# Altium project Transceiver-JB.PrjPcb
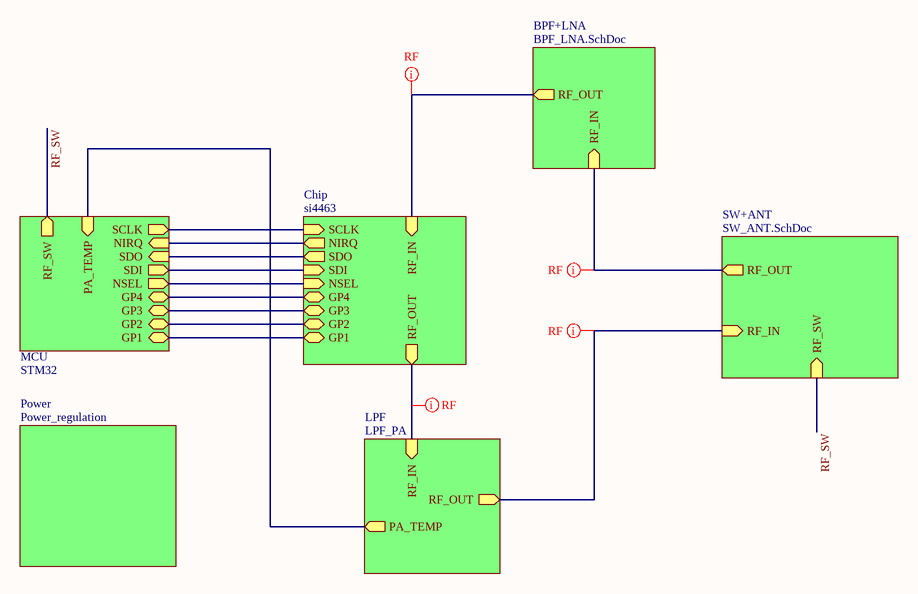
[diagram p0: Overview.SchDoc]
7 sheets, 95 parts. Net scope: hierarchical (ports join the sheet entries above them; power ports are global).
Board file: PCB_TRANSCIEVER.PcbDoc
Sheets:
  Overview.SchDoc
    STM32 = MCU.SchDoc
    Chip = si4463.SchDoc
    Power = Power_regulation.SchDoc
    LPF = LPF_PA.SchDoc
    BPF+LNA = BPF_LNA.SchDoc
    SW+ANT = SW_ANT.SchDoc

## Sheet Overview.SchDoc
size A; SheetNumber: 1; SheetTotal: 7

### Sub-sheets
BPF+LNA = BPF_LNA.SchDoc: RF_OUT (out), RF_IN (in)
Chip = si4463: SDI (in), SDO (out), NIRQ (out), SCLK (in), NSEL (in), RF_IN (in), RF_OUT (out), GP1 (bidir), GP2 (bidir), GP3 (bidir), GP4 (bidir)
LPF = LPF_PA: RF_IN (in), RF_OUT (out), PA_TEMP (out)
Power = Power_regulation: no entries
STM32 = MCU: NSEL (out), NIRQ (in), SDI (out), SDO (in), SCLK (out), RF_SW (out), GP1 (bidir), GP2 (bidir), GP3 (bidir), GP4 (bidir), PA_TEMP (in)
SW+ANT = SW_ANT.SchDoc: RF_OUT (out), RF_IN (in), RF_SW (in)

### Nets
NIRQ: sheet STM32/NIRQ, sheet Chip/NIRQ
NSEL: sheet STM32/NSEL, sheet Chip/NSEL
RF_SW: sheet STM32/RF_SW, sheet SW+ANT/RF_SW
SCLK: sheet STM32/SCLK, sheet Chip/SCLK
SDI: sheet STM32/SDI, sheet Chip/SDI
SDO: sheet STM32/SDO, sheet Chip/SDO
NetC5_1: sheet Chip/RF_IN, sheet BPF+LNA/RF_OUT
NetC31_2: sheet LPF/RF_OUT, sheet SW+ANT/RF_IN
NetC36_1: sheet Chip/RF_OUT, sheet LPF/RF_IN
NetC46_1: sheet BPF+LNA/RF_IN, sheet SW+ANT/RF_OUT
NetIC2_23: sheet STM32/PA_TEMP, sheet LPF/PA_TEMP
NetIC2_26: sheet STM32/GP1, sheet Chip/GP1
NetIC2_27: sheet STM32/GP2, sheet Chip/GP2
NetIC2_28: sheet STM32/GP3, sheet Chip/GP3
NetIC2_54: sheet STM32/GP4, sheet Chip/GP4

### Layout directives
rule Impedance Constraint [Min = 50.00    Max = 50.00    ]; net class RF: NetC5_1, NetC31_2, NetC36_1, NetC46_1

### Notes on the sheet
- DWG NO:
- REV:
- THIS DOCUMENT AND THE DATA DISCLOSED HEREIN OR
- HEREWITH IS THE PROPERTY OF ALTIUM LIMITED AND MAY
- BE FREELY DISTRIBUTED IN WHOLE. NO RIGHTS ARE
- RESERVED OR EXPRESS OR IMPLIED WARANTEE GIVEN.
- REVISION
- DESCRIPTION
- DATE
- APPROVED
- ENG:
- APPROVALS
- PROJECT
- DSN:
- CHK:
- REFERENCE DOCUMENTS
- PROJECT REVISION:
- TITLE
- DOCUMENT REVISION:
- DESIGN ITEM:
- BOM:
- FAB DWG:
- PCB DWG:
- ASSY DWG:
- SCALE:
- A2
- SIZE
- CAGE CODE
- FILE NAME
- DWG NO.
- SHEET
- OF
- REV

## Sheet MCU.SchDoc
size A; SheetNumber: 5; SheetTotal: 7
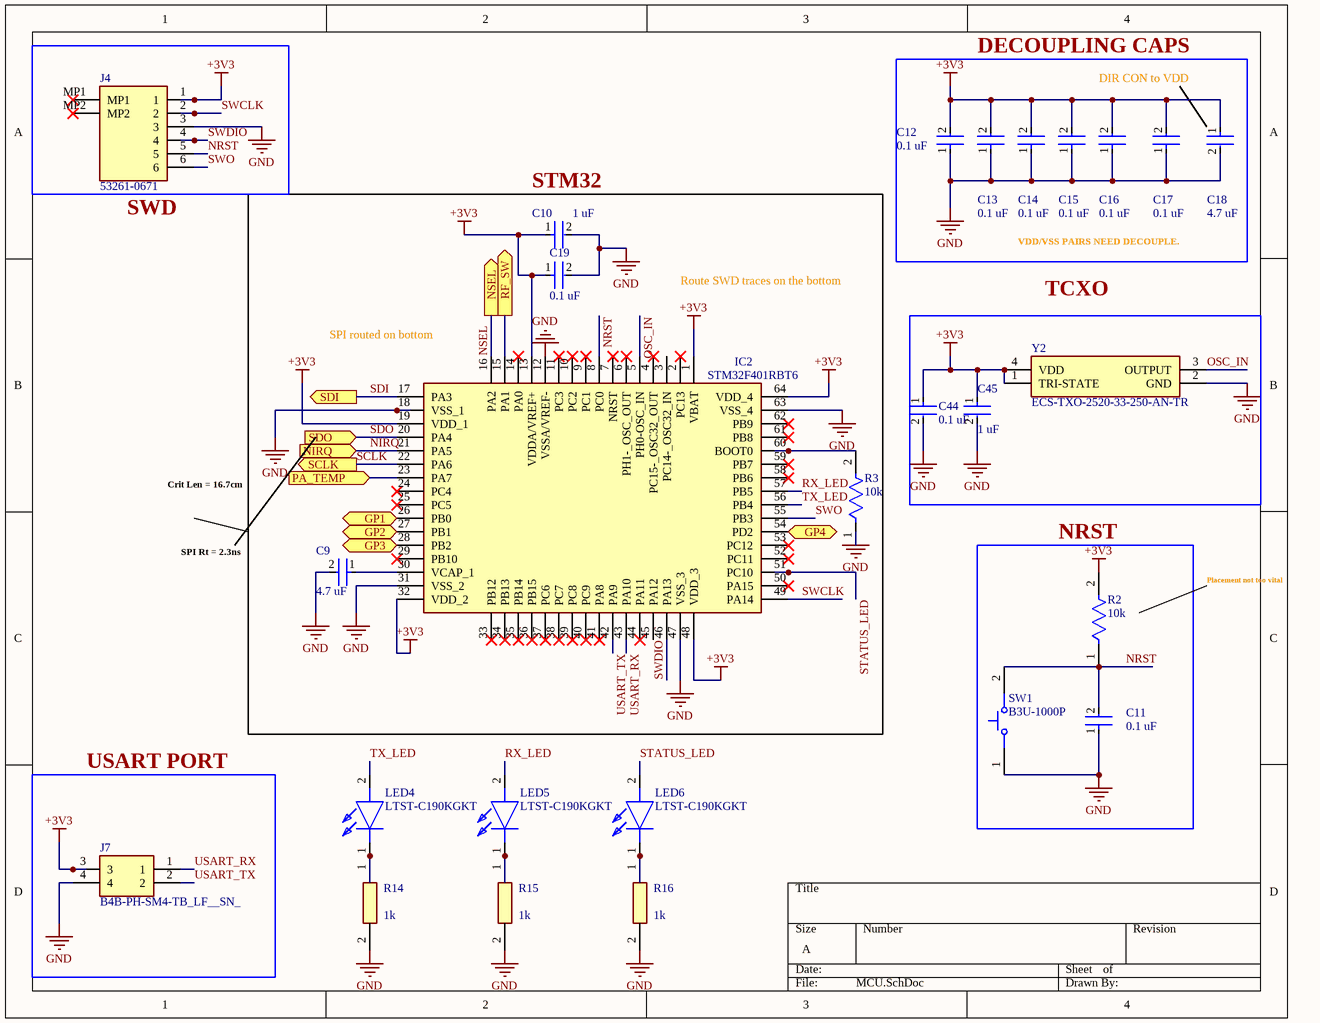
[diagram p1: MCU.SchDoc]

### Parts
C9  4.7 uF  [FP-GRM188-0_15-IPC_C]
C10  1 uF  [FP-C0402C105K9PACTU-MFG]
C11  0.1 uF  [FP-GRM033-0_03-MFG]
C12  0.1 uF  [FP-GRM033-0_03-MFG]
C13  0.1 uF  [FP-GRM033-0_03-MFG]
C14  0.1 uF  [FP-GRM033-0_03-MFG]
C15  0.1 uF  [FP-GRM033-0_03-MFG]
C16  0.1 uF  [FP-GRM033-0_03-MFG]
C17  0.1 uF  [FP-GRM033-0_03-MFG]
C18  4.7 uF  [FP-GRM188-0_15-IPC_C]
C19  0.1 uF  [FP-GRM033-0_03-MFG]
C44  0.1 uF  [FP-GRM033-0_03-MFG]
C45  1 uF  [FP-C0402C105K9PACTU-MFG]
IC2  STM32F401RBT6  [QFP50P1200X1200X160-64N]
J4  53261-0671  [532610671]
J7  B4B-PH-SM4-TB_LF__SN_  [B4B-PH-SM4_1]
LED4  LTST-C190KGKT  [LEDC1608X80N]
LED5  LTST-C190KGKT  [LEDC1608X80N]
LED6  LTST-C190KGKT  [LEDC1608X80N]
R2  10k  [FP-RMCF0402-IPC_C]
R3  10k  [FP-RMCF0402-IPC_C]
R14  1k  [RESC1608X55N]
R15  1k  [RESC1608X55N]
R16  1k  [RESC1608X55N]
SW1  B3U-1000P  [OMRON-B3U-1000_V]
Y2  ECS-TXO-2520-33-250-AN-TR  [ECSTXO252033250ANTR]

### Blocks framed on the sheet
DECOUPLING CAPS: C12-C18
STM32: C9 C10 C19 IC2 R3
TCXO: C44 C45 Y2
NRST: C11 R2 SW1
USART PORT: J7

### Ports
GP1 (bidir, see Overview[1B], si4463[3A]), GP2 (bidir, see Overview[1B], si4463[3A]), GP3 (bidir, see Overview[1B], si4463[3B]), GP4 (bidir, see Overview[1B], si4463[3B]), NIRQ (in, see Overview[1B], si4463[3A]), NSEL (out, see Overview[1B], si4463[3B]), PA_TEMP (in, see Overview[1B], LPF_PA[1C]), RF_SW (out, see Overview[1B], SW_ANT[3C]), SCLK (out, see Overview[1B], si4463[3A]), SDI (out, see Overview[1B], si4463[3B]), SDO (in, see Overview[1B], si4463[3A])

### Nets
+3V3: C10.1 C12.2 C13.2 C14.2 C15.2 C16.2 C17.2 C18.1 C19.1 C44.1 C45.1 IC2.1(VBAT) IC2.13(VDDA/VREF+) IC2.19(VDD_1) IC2.32(VDD_2) IC2.48(VDD_3) IC2.64(VDD_4) J4.1 J7.3 R2.2 Y2.1(TRI-STATE) Y2.4(VDD)  [project net 3V3]
GND: C9.2 C10.2 C11.1 C12.1 C13.1 C14.1 C15.1 C16.1 C17.1 C18.2 C19.2 C44.2 C45.2 IC2.12(VSSA/VREF-) IC2.18(VSS_1) IC2.31(VSS_2) IC2.47(VSS_3) IC2.63(VSS_4) J4.3 J7.4 R3.1 R14.2 R15.2 R16.2 SW1.1 Y2.2(GND)
NIRQ: IC2.21(PA5) ; port NIRQ
NRST: C11.2 IC2.8(PC0) J4.5 R2.1 SW1.2
NSEL: IC2.16(PA2) ; port NSEL
OSC_IN: IC2.5(PH0-OSC_IN) Y2.3(OUTPUT)
RF_SW: IC2.15(PA1) ; port RF_SW
RX_LED: IC2.57(PB5) LED5.2(A)
SCLK: IC2.22(PA6) ; port SCLK
SDI: IC2.17(PA3) ; port SDI
SDO: IC2.20(PA4) ; port SDO
STATUS_LED: IC2.51(PC10) LED6.2(A)
SWCLK: IC2.49(PA14) J4.2
SWDIO: IC2.46(PA13) J4.4
SWO: IC2.55(PB3) J4.6
TX_LED: IC2.56(PB4) LED4.2(A)
USART_RX: IC2.43(PA10) J7.1
USART_TX: IC2.42(PA9) J7.2
NetC9_1: C9.1 IC2.30(VCAP_1)
NetIC2_23: IC2.23(PA7) ; port PA_TEMP
NetIC2_26: IC2.26(PB0) ; port GP1
NetIC2_27: IC2.27(PB1) ; port GP2
NetIC2_28: IC2.28(PB2) ; port GP3
NetIC2_54: IC2.54(PD2) ; port GP4
NetIC2_60: IC2.60(BOOT0) R3.2
NetLED4_1: LED4.1(K) R14.1
NetLED5_1: LED5.1(K) R15.1
NetLED6_1: LED6.1(K) R16.1

Not connected (* = marked no-connect by the designer): IC2 2(PC13)* 3(PC14-_OSC32_IN) 4(PC15-_OSC32_OUT)* 6(PH1-_OSC_OUT)* 7(NRST)* 9(PC1)* 10(PC2)* 11(PC3)* 14(PA0)* 24(PC4)* 25(PC5)* 29(PB10)* 33(PB12)* 34(PB13)* 35(PB14)* 36(PB15)* 37(PC6)* 38(PC7)* 39(PC8)* 40(PC9)* 41(PA8)* 44(PA11)* 45(PA12) 50(PA15)* 52(PC11)* 53(PC12)* 58(PB6)* 59(PB7)* 61(PB8)* 62(PB9)*; J4 MP1* MP2*

### Notes on the sheet
- DIR CON to VDD
- (near J4) SWD
- Route SWD traces on the bottom
- VDD/VSS PAIRS NEED DECOUPLE.
- (near IC2) SPI routed on bottom
- Crit Len = 16.7cm
- SPI Rt = 2.3ns
- Placement not too vital

### Library data of the parts
C9 C18 = CMP-2006-02523-2: Chip Multilayer Ceramic Capacitors for General Purpose, 0603, 4.7uF, X5R, 15%, 10%, 25V Name: GRM188R61E475KE11D; Case Code (Metric): 1608; Max Operating Temperature: 85°C; REACH SVHC: No SVHC; Voltage Rating: 25V; Dielectric: X5R; Packaging: Cut Tape; Width: 0.031inch; Min Operating Temperature: -55°C; Lead Free: Lead Free; Capacitance: 4.7uF; Height: 0.8mm; Case Code (Imperial): 0603; Length: 1.6mm; Voltage Rating (DC): 25V; Case/Package: 0603; Voltage: 25V; Tolerance: 10%; Thickness: 0.031inch; Mount: Surface Mount; Material: Ceramic; Package Quantity: 4000; Depth: 0.8mm
C10 C45 = CMP-2008-02075-2: CAP CER 1UF 6.3V X5R 0402 Name: C0402C105K9PACTU; Tolerance: 10%; Dielectric Material: Ceramic; Series: C; Lead Free: Lead Free; Min Operating Temperature: -55°C; Capacitance: 1uF; Voltage Rating (DC): 6.3V; Number of Pins: 2; REACH SVHC: No SVHC; Mount: Surface Mount; Lead Pitch: 0.3mm; Case Code (Imperial): 0402; RoHS Compliant: Yes; Radiation Hardening: No; Construction: Flat; Depth: 0.5mm; Case/Package: 0402; Termination: SMD/SMT; Height: 0.5mm; Thickness: 0.022inch; Voltage: 6.3V; Dielectric: X5R; Width: 0.02inch; Voltage Rating: 6.3V; Max Operating Temperature: 85°C; Packaging: Tape and Reel; Package Quantity: 1; Length: 1mm
C11-C17 C19 C44 = CMP-06035-019037-1: Chip Multilayer Ceramic Capacitors for General Purpose, 0201, 0.10uF, X7S, 22%, 10%, 16V Name: GRM033C71C104KE14D; Capacitance: 100nF; Dielectric: X7S; Tolerance: 10%; Voltage Rating (DC): 16V; Height: 0.3mm; Max Operating Temperature: 125°C; Case Code (Metric): 0603; Termination: SMD/SMT; Min Operating Temperature: -55°C; Mount: Surface Mount; Case/Package: 0201; Weight: 1.2E-05oz; Package Quantity: 15000; Length: 0.024inch; Voltage Rating: 16V; Case Code (Imperial): 0201; Packaging: Tape and Reel; Thickness: 0.013inch; Width: 0.3mm
IC2 = STM32F401RBT6: Integrated Circuit; Manufacturer_Name: STMicroelectronics; Datasheet Link: https://www.st.com/resource/en/datasheet/stm32f401cb.pdf; Height: 1.6mm; Manufacturer_Part_Number: STM32F401RBT6; Mouser Part Number: 511-STM32F401RBT6; Mouser Price/Stock: https://www.mouser.co.uk/ProductDetail/STMicroelectronics/STM32F401RBT6?qs=4ccVDqXDOrn4COlKBEB%252BDA%3D%3D; Arrow Part Number: STM32F401RBT6; Arrow Price/Stock: https://www.arrow.com/en/products/stm32f401rbt6/stmicroelectronics?region=europe
J4 = 53261-0671: Connector; Manufacturer_Name: Molex; Datasheet Link: https://www.molex.com/pdm_docs/sd/532610671_sd.pdf; Height: 3.6mm; Manufacturer_Part_Number: 53261-0671; Mouser Part Number: 538-53261-0671; Mouser Price/Stock: https://www.mouser.co.uk/ProductDetail/Molex/53261-0671?qs=%252B72YyncTwW9Wyr77z4J2cA%3D%3D; Arrow Part Number: 53261-0671; Arrow Price/Stock: https://www.arrow.com/en/products/53261-0671/molex?region=nac
J7 = B4B-PH-SM4-TB_LF__SN_: Connector; Manufacturer_Name: JST (JAPAN SOLDERLESS TERMINALS); Manufacturer_Part_Number: B4B-PH-SM4-TB(LF)(SN); Datasheet Link: https://datasheet.datasheetarchive.com/originals/distributors/Datasheets_SAMA/75c02eb1799788a6b14d7c521ee36df4.pdf; Mouser Part Number: N/A; Mouser Price/Stock: https://www.mouser.co.uk/ProductDetail/JST-Commercial/B4B-PH-SM4-TBLFSN?qs=QpmGXVUTftEshE2WNd%252BKhA%3D%3D; Arrow Part Number: B4B-PH-SM4-TB(LF)(SN); Arrow Price/Stock: https://www.arrow.com/en/products/b4b-ph-sm4-tb-lf-sn/jst-manufacturing?utm_currency=USD&region=europe
LED4-LED6 = LTST-C190KGKT: LED; Manufacturer_Name: Lite-On; Datasheet Link: http://uk.rs-online.com/web/p/visible-leds/6920988/; Height: 0.8mm; Manufacturer_Part_Number: LTST-C190KGKT; Mouser Part Number: 859-LTST-C190KGKT; Mouser Price/Stock: https://www.mouser.co.uk/ProductDetail/Lite-On/LTST-C190KGKT?qs=205qCy6M2Q%252BAdcgwUZktqw%3D%3D; Arrow Part Number: LTST-C190KGKT; Arrow Price/Stock: https://www.arrow.com/en/products/ltst-c190kgkt/lite-on-technology?utm_currency=USD&region=nac
R2 R3 = CMP-26527-000128-1: 10kΩ ±1% 0.063W 0402 Thick Film Chip Resistor AEC-Q200 compliant Name: RMCF0402FT10K0; Temperature Coefficient: 100ppm/°C; Power Rating: 62.5mW; Resistance: 10kR; Max Power Dissipation: 63mW; Width: 0.02inch; Case/Package: 0402; Depth: 0.5mm; Resistor Type: Thick Film; Series: RMCF; Length: 1mm; Contact Plating: Tin; Tolerance: 1%; Number of Terminations: 2; Height: 0.016inch; Military Standard: Not; Case Code (Imperial): 0402; Size Code: 0402; Construction: Rectangular; Radiation Hardening: No; RoHS Compliant: Yes; Case Code (Metric): 1005; Packaging: Tape and Reel; Lead Free: Lead Free; Min Operating Temperature: -55°C; Max Operating Temperature: 155°C; Mount: Surface Mount; Features: Automotive AEC-Q200
R14-R16 = RC0603FR-131KL: Manufacturer_Name: Yageo Group; Datasheet Link: http://www.yageo.com/documents/recent/PYu-RC0603_51_RoHS_L_v5.pdf; Height: 0.55mm; Manufacturer_Part_Number: RC0603FR-131KL; Mouser Part Number: 603-RC0603FR-131KL; Mouser Price/Stock: https://www.mouser.co.uk/ProductDetail/Yageo/RC0603FR-131KL?qs=EiqXWrxQq60RfsVJHVHHSQ%3D%3D; Arrow Part Number: RC0603FR-131KL; Arrow Price/Stock: https://www.arrow.com/en/products/rc0603fr-131kl/yageo
SW1 = CMP-011-00000-2: Tactile Switch, SPST-NO, 0.05 A, 12 V, -25 to 70 degC, 2-Pin SMD, RoHS, Tape and Reel; Manufacturer: Omron Electronic Components; IP Rating: IP40; Current Rating: 50mA; Max Contact Resistance: 100mohm; Operating Force: 153gf; Throw Configuration: SPST; Resistance: 0.1Ohm; Max Voltage Rating (DC): 12V; Contact Material: Silver; Max Current Rating: 50mA; Datasheet URL: http://www.omron.com/ecb/products/pdf/en-b3u.pdf; Mounting Technology: SM; Case/Package: B3U-1000; Packaging: TapeandReel; Package Reference: B3U-1000; Manufacturer URL: http://www.omron.com/; Datasheet Version: Jan-15; RoHS Compliant: True; Max Operating Temperature: 70°C; Contact Current Rating: 50mA; Package Quantity: 3500; Package Description: 2-Pin Surface Mount Device, Body 3 x 2.5 mm; Voltage Rating (DC): 12V; Min Operating Temperature: -25°C; Voltage Rating: 12V
Y2 = ECS-TXO-2520-33-250-AN-TR: Crystal or Oscillator; Manufacturer_Name: ECS; Datasheet Link: https://ecsxtal.com/store/pdf/ECS-TXO-2520.pdf; Height: 1mm; Manufacturer_Part_Number: ECS-TXO-2520-33-250-AN-TR; Mouser Part Number: 520-T2520-33-250-ANT; Mouser Price/Stock: https://www.mouser.co.uk/ProductDetail/ECS/ECS-TXO-2520-33-250-AN-TR?qs=KAq9QXcE8HCY8Xed3s4jaA%3D%3D; Arrow Part Number: ECS-TXO-2520-33-250-AN-TR; Arrow Price/Stock: https://www.arrow.com/en/products/ecs-txo-2520-33-250-an-tr/ecs-international

## Sheet si4463.SchDoc
size A; SheetNumber: 4; SheetTotal: 7
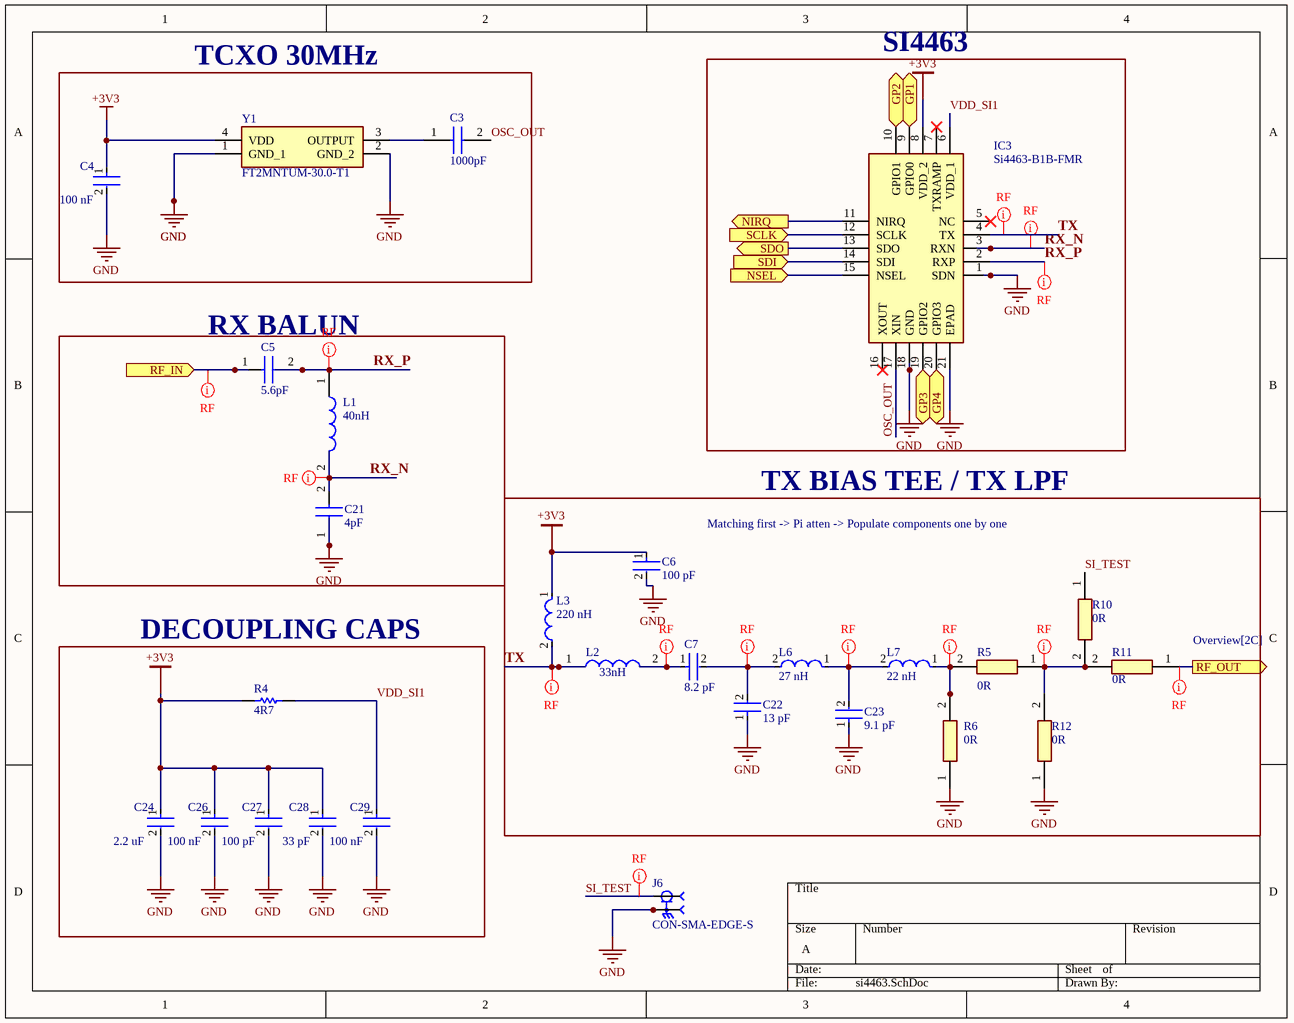
[diagram p2: si4463.SchDoc]

### Parts
C3  1000pF  [C0402]
C4  100 nF  [FP-GCM155-0_05-IPC_C]
C5  5.6pF  [CAPC1005X55N]
C6  100 pF  [FP-GQM187-0_15-MFG]
C7  8.2 pF  [FP-GJM155-0_05-MFG]
C21  4pF  [CAPC1005X55N]
C22  13 pF  [FP-GJM155-0_05-IPC_B]
C23  9.1 pF  [FP-GJM155-0_05-IPC_B]
C24  2.2 uF  [FP-GRM155-0_2-IPC_A]
C26  100 nF  [FP-GCM155-0_05-IPC_C]
C27  100 pF  [FP-GQM187-0_15-MFG]
C28  33 pF  [FP-GJM155-0_05-MFG]
C29  100 nF  [FP-GCM155-0_05-IPC_C]
IC3  Si4463-B1B-FMR  [QFN50P400X400X90-21N-D]
J6  CON-SMA-EDGE-S  [RFSOLUTIONS_CON-SMA-EDGE-S]
L1  40nH  [LQW15CNR20J00B]
L2  33nH  [LQW15CNR20J00B]
L3  220 nH  [FP-LQW18AN_80-MFG]
L6  27 nH  [FP-LQW15AN_00-W0_5-0_1-MFG]
L7  22 nH  [FP-LQW15AN_00-W0_6-0_1-MFG]
R4  4R7  [RESC3216X65X100LL20T15]
R5  0R  [RESC1608X55N]
R6  0R  [RESC1608X55N]
R10  0R  [RESC1005X40N]
R11  0R  [RESC1608X55N]
R12  0R  [RESC1608X55N]
Y1  FT2MNTUM-30.0-T1  [FT2MNTUM300T1]

### Blocks framed on the sheet
TCXO 30MHz: C3 C4 Y1
SI4463: IC3
RX BALUN: C5 C21 L1
TX BIAS TEE / TX LPF: C6 C7 C22 C23 L2 L3 L6 L7 R5 R6 R10-R12
DECOUPLING CAPS: C24 C26-C29 R4

### Ports
GP1 (bidir, see Overview[2B], MCU[2C]), GP2 (bidir, see Overview[2B], MCU[2C]), GP3 (bidir, see Overview[2B], MCU[2C]), GP4 (bidir, see Overview[2B], MCU[3C]), NIRQ (out, see Overview[2B], MCU[1B]), NSEL (in, see Overview[2B], MCU[2B]), RF_IN (in, see Overview[2B]), RF_OUT (out, see Overview[2C]), SCLK (in, see Overview[2B], MCU[1B]), SDI (in, see Overview[2B], MCU[1B]), SDO (out, see Overview[2B], MCU[1B])

### Nets
+3V3: C4.1 C6.1 C24.1 C26.1 C27.1 C28.1 IC3.8(VDD_2) L3.1 R4.1 Y1.4(VDD)  [project net 3V3]
GND: C4.2 C6.2 C21.1 C22.1 C23.1 C24.2 C26.2 C27.2 C28.2 C29.2 IC3.1(SDN) IC3.18(GND) IC3.21(EPAD) J6.G1 J6.G2 J6.G3 J6.G4 R6.1 R12.1 Y1.1(GND_1) Y1.2(GND_2)
NIRQ: IC3.11(NIRQ) ; port NIRQ
NSEL: IC3.15(NSEL) ; port NSEL
OSC_OUT: C3.2 IC3.17(XIN)
RX_N: C21.2 IC3.3(RXN) L1.2
RX_P: C5.2 IC3.2(RXP) L1.1
SCLK: IC3.12(SCLK) ; port SCLK
SDI: IC3.14(SDI) ; port SDI
SDO: IC3.13(SDO) ; port SDO
SI_TEST: J6.1 R10.1
TX: IC3.4(TX) L2.1 L3.2
VDD_SI1: C29.1 IC3.6(VDD_1) R4.2
NetC3_1: C3.1 Y1.3(OUTPUT)
NetC5_1: C5.1 ; port RF_IN
NetC7_1: C7.1 L2.2
NetC7_2: C7.2 C22.2 L6.2
NetC23_2: C23.2 L6.1 L7.2
NetC36_1: R11.1 ; port RF_OUT
NetIC2_26: IC3.9(GPIO0) ; port GP1
NetIC2_27: IC3.10(GPIO1) ; port GP2
NetIC2_28: IC3.19(GPIO2) ; port GP3
NetIC2_54: IC3.20(GPIO3) ; port GP4
NetL7_1: L7.1 R5.2 R6.2
NetR5_1: R5.1 R10.2 R11.2 R12.2

Not connected (* = marked no-connect by the designer): IC3 5(NC)* 7(TXRAMP)* 16(XOUT)*

### Layout directives
rule Impedance Constraint [Min = 50.00    Max = 50.00    ]; net class RF: NetC5_1, NetC7_1, NetC7_2, NetC23_2, NetC36_1, NetL7_1, NetR5_1, RX_N, RX_P, SI_TEST, TX

### Notes on the sheet
- Matching first -> Pi atten -> Populate components one by one

### Library data of the parts
C3 = C0402C102K5RAC-TU: Manufacturer_Name: Yageo Group; Datasheet Link: https://www.kemet.com/specsheet/C0402C102K5RACTU; Height: 0.55mm; Manufacturer_Part_Number: C0402C102K5RAC-TU
C4 C26 C29 = CMP-2008-03711-3: Ceramic Capacitor for Automotive 100nF ±10% 16VDC X7R 0402 Paper T/R Name: GCM155R71C104KA55D; Voltage Rating (DC): 16V; Termination: SMD/SMT; Length: 1mm; Voltage: 16V; Mount: Surface Mount; Packaging: Tape and Reel; Case Code (Metric): 1005; Case/Package: 0402; Voltage Rating: 16V; Min Operating Temperature: -55°C; Case Code (Imperial): 0402; Ratings: AEC-Q200; Height: 0.5mm; Tolerance: 10%; Width: 0.02inch; Radiation Hardening: No; Depth: 0.5mm; Capacitance: 100nF; Max Operating Temperature: 125°C; Package Quantity: 1; REACH SVHC: No SVHC; Thickness: 0.022inch; Dielectric: X7R; Lead Free: Lead Free
C5 = GJM1555C1H5R6BB01D: Manufacturer_Name: Murata Electronics; Datasheet Link: https://search.murata.co.jp/Ceramy/image/img/A01X/G101/ENG/GJM1555C1H5R6BB01-01A.pdf; Height: 0.55mm; Manufacturer_Part_Number: GJM1555C1H5R6BB01D; Mouser Part Number: 81-GJM1555C1H5R6BB1D; Mouser Price/Stock: https://www.mouser.co.uk/ProductDetail/Murata-Electronics/GJM1555C1H5R6BB01D?qs=Er06SXQpt%252B61VPMQL%252BpEbg%3D%3D; Arrow Part Number: GJM1555C1H5R6BB01D; Arrow Price/Stock: https://www.arrow.com/en/products/gjm1555c1h5r6bb01d/murata-manufacturing?region=nac
C6 C27 = CMP-06035-018516-1: Ceramic Capacitor 100pF ±5% 250VDC C0G 0603 Paper T/R Name: GQM1875C2E101JB12D; Voltage Rating (DC): 250V; Min Operating Temperature: -55°C; Case Code (Metric): 1608; Lead Free: Lead Free; Length: 1.6mm; Voltage Rating: 250V; Termination: SMD/SMT; Packaging: Tape and Reel; Width: 0.031inch; Tolerance: 5%; Thickness: 0.031inch; Capacitance: 100pF; Package Quantity: 4000; Case/Package: 0603; Mount: Surface Mount; Max Operating Temperature: 125°C; Dielectric: C0G; Depth: 0.8mm; Case Code (Imperial): 0603
C7 = CMP-2008-03887-2: Multi-Layer Ceramic Capacitor 8.2pF C0G  ±0.05pF 0402 Paper T/R; Voltage Rating (DC): 50V; Termination: SMD/SMT; Packaging: Tape and Reel; Case Code (Imperial): 0402; Min Operating Temperature: -55°C; Mount: Surface Mount; Case Code (Metric): 1005; Height: 0.5mm; Length: 1mm; Dielectric: C0G; Max Operating Temperature: 125°C; Voltage Rating: 50V; Case/Package: 0402; Package Quantity: 10000; Depth: 0.5mm; Radiation Hardening: No; Width: 0.02inch; Capacitance: 8.2pF; Thickness: 0.022inch
C21 = GJM1555C1H4R0BB01D: Manufacturer_Name: Murata Electronics; Datasheet Link: https://search.murata.co.jp/Ceramy/image/img/A01X/G101/ENG/GJM1555C1H4R0BB01-01A.pdf; Height: 0.55mm; Manufacturer_Part_Number: GJM1555C1H4R0BB01D; Mouser Part Number: 81-GJM1555C1H4R0BB01; Mouser Price/Stock: https://www.mouser.com/Search/Refine.aspx?Keyword=81-GJM1555C1H4R0BB01
C22 = CMP-2008-03801-2: Multi-Layer Ceramic Capacitor 13pF C0G  ±2% 0402 Paper T/R Name: GJM1555C1H130GB01D; Voltage Rating (DC): 50V; Depth: 0.5mm; Min Operating Temperature: -55°C; Max Operating Temperature: 125°C; Packaging: Tape and Reel; Tolerance: 2%; Width: 0.5mm; Case/Package: 0402; Package Quantity: 1; Height: 0.5mm; Case Code (Metric): 1005; Radiation Hardening: No; Length: 1mm; Thickness: 0.022inch; Dielectric: C0G; Case Code (Imperial): 0402; Mount: Surface Mount; Capacitance: 13pF; Termination: SMD/SMT; Voltage Rating: 50V
C23 = CMP-2008-03892-2: Multi-Layer Ceramic Capacitor 9.1pF C0G  ±0.1pF 0402 Paper T/R Name: GJM1555C1H9R1BB01D; Voltage Rating (DC): 50V; Package Quantity: 10000; Termination: SMD/SMT; Min Operating Temperature: -55°C; Capacitance: 9.1pF; Mount: Surface Mount; Length: 1mm; Height: 0.5mm; Lead Free: Lead Free; Depth: 0.5mm; Thickness: 0.022inch; Case Code (Imperial): 0402; Radiation Hardening: No; Packaging: Tape and Reel; Case/Package: 0402; Max Operating Temperature: 125°C; Case Code (Metric): 1005; Width: 0.02inch; Dielectric: C0G; Voltage Rating: 50V
C24 = CMP-06035-014902-1: Chip Multilayer Ceramic Capacitors for General Purpose, 0402, 2.2uF, X7S, 22%, 10%, 6.3V Name: GRM155C70J225KE11D; Dielectric: X7S; Case Code (Metric): 1005; Case/Package: 0402; Voltage Rating (DC): 6.3V; Length: 0.039inch; Max Operating Temperature: 125°C; Tolerance: 10%; Width: 0.02inch; Mount: Surface Mount; Packaging: Tape and Reel; Package Quantity: 10000; Voltage Rating: 6.3V; Resistor Type: Ceramic; Min Operating Temperature: -55°C; Case Code (Imperial): 0402; Termination: SMD/SMT; Weight: 0.000212oz; Height: 0.5mm; Thickness: 0.022inch; Capacitance: 2.2uF
C28 = CMP-06035-057988-1: Multi-Layer Ceramic Capacitor 33pF C0G  ±5% 0402 Paper T/R Name: GJM1555C1H330JB01D; Voltage Rating (DC): 50V; Width: 500um; Capacitance: 33pF; Dielectric: C0G; Length: 1mm; Thickness: 500um; Tolerance: 5%
IC3 = Si4463-B1B-FMR: Integrated Circuit; Manufacturer_Name: Silicon Labs; Datasheet Link: https://www.silabs.com/documents/public/data-sheets/Si4464-63-61-60.pdf; Height: 0.9mm; Manufacturer_Part_Number: Si4463-B1B-FMR; Mouser Part Number: 634-SI4463-B1B-FMR; Mouser Price/Stock: https://www.mouser.co.uk/ProductDetail/Silicon-Labs/SI4463-B1B-FMR?qs=p9T7GgSe1IEZK64CVhf5Sg%3D%3D; Arrow Part Number: SI4463-B1B-FMR; Arrow Price/Stock: https://www.arrow.com/en/products/si4463-b1b-fmr/silicon-labs?utm_currency=USD&region=nac
J6 = CMP-002-00088-1: SMA Connector Jack, Female Socket - Board Edge, End Launch Solder; MF: RF Solutions; Source: CON-SMA-EDGE-S.SchLib; Check_prices: https://www.snapeda.com/parts/CON-SMA-EDGE-S/RF+Solutions/view-part/?ref=eda; Component Type: Standard; Purchase-URL: https://pricing.snapeda.com/search/part/CON-SMA-EDGE-S/?ref=eda; MP: CON-SMA-EDGE-S; SnapEDA_Link: https://www.snapeda.com/parts/CON-SMA-EDGE-S/RF+Solutions/view-part/?ref=snap; Pins: 5; Case/Package: None; Value: *; Digi-Key_Part_Number: CON-SMA-EDGE-S-ND; Design Item ID: CON-SMA-EDGE-S
L1 = LQW15AN40NJ00D: Manufacturer_Name: Murata Electronics; Datasheet Link: https://search.murata.co.jp/Ceramy/image/img/P02/JELF243A-0050.pdf; Height: 0.6mm; Manufacturer_Part_Number: LQW15AN40NJ00D; Mouser Part Number: 81-LQW15AN40NJ00D; Mouser Price/Stock: https://www.mouser.com/Search/Refine.aspx?Keyword=81-LQW15AN40NJ00D; Arrow Part Number: LQW15AN40NJ00D; Arrow Price/Stock: https://www.arrow.com/en/products/lqw15an40nj00d/murata-manufacturing
L2 = LQW15AN33NJ00D: Manufacturer_Name: Murata Electronics; Datasheet Link: https://search.murata.co.jp/Ceramy/image/img/P02/JELF243A-0050.pdf; Height: 0.6mm; Manufacturer_Part_Number: LQW15AN33NJ00D; Mouser Part Number: 81-LQW15AN33NJ00D; Mouser Price/Stock: https://www.mouser.co.uk/ProductDetail/Murata-Electronics/LQW15AN33NJ00D?qs=ET5ky%252B0fbz2%252Bim80KCEoEg%3D%3D; Arrow Part Number: LQW15AN33NJ00D; Arrow Price/Stock: https://www.arrow.com/en/products/lqw15an33nj00d/murata-manufacturing?region=nac
L3 = CMP-06042-006715-1: Wire Wound RF Inductor for Automotive 220nH ±5% 280mA 2.08Ω 0603 (1608) Name: LQW18ANR22J8ZD
L6 = CMP-06042-004466-1: Wire Wound RF Inductor 27nH ±3% 280mA 0.52Ω 0402 (1005) Name: LQW15AN27NH00D; Test Frequency: 100MHz; Shielding: Unshielded; Current: 260mA; Self Resonant Frequency: 3.5GHz; DC Resistance (DCR): 520mR; Q Factor: 25; Core Material: Non-Magnetic; Current Rating: 280mA; Max Operating Temperature: 125°C; Width: 0.02inch; Tolerance: 3%; Mount: Surface Mount; Case Code (Imperial): 0402; Weight: 2.8E-05oz; Depth: 0.6mm; Packaging: Tape and Reel; Height - Seated (Max): 0.024inch; DC Current: 280mA; Length: 1mm; Inductance: 27nH; Max DC Current: 280mA; Resistor Type: Wirewound; Min Operating Temperature: -55°C; Lead Free: Lead Free; Package Quantity: 10000; Height: 0.5mm; Termination: SMD/SMT; Case/Package: 0402; Military Standard: Not; Case Code (Metric): 1005
L7 = CMP-06042-001125-1: Wire Wound RF Inductor 22nH ±3% 310mA 0.3Ω 0402 (1005) Name: LQW15AN22NH00D; Self Resonant Frequency: 4GHz; Q Factor: 25; Current: 750mA; Shielding: Unshielded; DC Resistance (DCR): 300mR; Test Frequency: 100MHz; Core Material: Non-Magnetic; Lead Free: Lead Free; Height - Seated (Max): 0.024inch; Max Operating Temperature: 125°C; Current Rating: 310mA; Min Operating Temperature: -55°C; Inductance: 22nH; Resistor Type: Wirewound; Case Code (Imperial): 0402; Weight: 2.8E-05oz; Case/Package: 0402; DC Current: 310mA; Height: 0.5mm; Width: 0.5mm; Max DC Current: 310mA; Radiation Hardening: No; Case Code (Metric): 1005; Length: 1mm; Military Standard: Not; Mount: Surface Mount; Termination: SMD/SMT; Tolerance: 3%; Packaging: Tape and Reel; Depth: 0.7mm; Package Quantity: 10000
R4 = CMP-2003-04707-1: Name: RL1632R-4R70-F; Manufacturer: Susumu; Part Number: RL1632R-4R70-F
R5 R6 R11 R12 = RC0603JR-070RL: Manufacturer_Name: Yageo Group; Datasheet Link: http://www.yageo.com/documents/recent/PYu-RC0603_51_RoHS_L_v5.pdf; Height: 0.55mm; Manufacturer_Part_Number: RC0603JR-070RL; Mouser Part Number: 603-RC0603JR-070RL; Mouser Price/Stock: https://www.mouser.co.uk/ProductDetail/YAGEO/RC0603JR-070RL?qs=2cAdsCoAWRGWyPcuXgGiXQ%3D%3D; Arrow Part Number: RC0603JR-070RL; Arrow Price/Stock: https://www.arrow.com/en/products/rc0603jr-070rl/yageo?utm_currency=USD&region=nac
R10 = RC0402JR-070RL: Manufacturer_Name: Yageo Group; Datasheet Link: https://www.yageo.com/upload/media/product/products/datasheet/rchip/PYu-RC_Group_51_RoHS_L_12.pdf; Height: 0.4mm; Manufacturer_Part_Number: RC0402JR-070RL; Mouser Part Number: 603-RC0402JR-070RL; Mouser Price/Stock: https://www.mouser.co.uk/ProductDetail/YAGEO/RC0402JR-070RL?qs=5Bml4Cp94iv7ykKkzPrwpQ%3D%3D; Arrow Part Number: RC0402JR-070RL; Arrow Price/Stock: https://www.arrow.com/en/products/rc0402jr-070rl/yageo.html?utm_currency=USD&region=europe
Y1 = FT2MNTUM-30.0-T1: Crystal or Oscillator; Manufacturer_Name: ABRACON; Datasheet Link: https://abracon.com/datasheets/FT2MN.pdf; Height: 1mm; Manufacturer_Part_Number: FT2MNTUM-30.0-T1; Mouser Part Number: 815-FT2MNTUM-30.0-T1; Mouser Price/Stock: https://www.mouser.co.uk/ProductDetail/ABRACON/FT2MNTUM-30.0-T1?qs=9vOqFld9vZU1LRBjatCK%2Fw%3D%3D; Arrow Part Number: FT2MNTUM-30.0-T1; Arrow Price/Stock: https://www.arrow.com/en/products/ft2mntum-30.0-t1/abracon?region=nac

## Sheet Power_regulation.SchDoc
size A; SheetNumber: 3; SheetTotal: 7; SPICEModelCachePAJFOGTT: <root> / <DocumentId>PAJFOGTT</DocumentId> / </root>
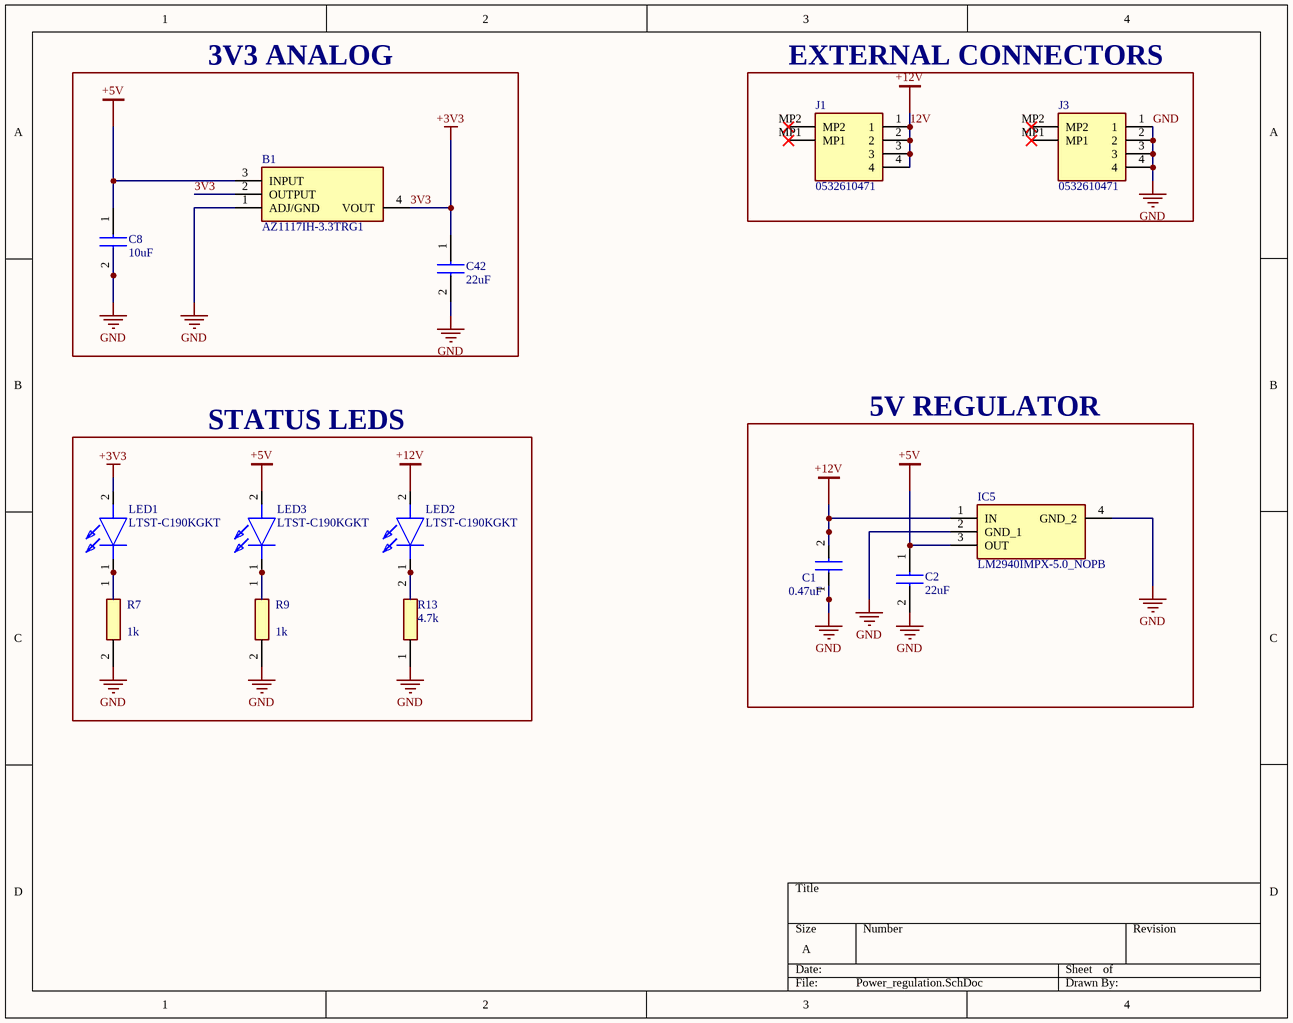
[diagram p3: Power_regulation.SchDoc]

### Parts
B1  AZ1117IH-3.3TRG1  [SOT230P700X180-4N]
C1  0.47uF  [CAPC1608X90N]
C2  22uF  [CAPC1608X100N]
C8  10uF  [GRM15x]
C42  22uF  [CAPC1608X100N]
IC5  LM2940IMPX-5.0_NOPB  [SOT230P700X180-4N]
J1  0532610471  [0532610471]
J3  0532610471  [0532610471]
LED1  LTST-C190KGKT  [LEDC1608X80N]
LED2  LTST-C190KGKT  [LEDC1608X80N]
LED3  LTST-C190KGKT  [LEDC1608X80N]
R7  1k  [RESC1608X55N]
R9  1k  [RESC1608X55N]
R13  4.7k  [RESC1608X55N]

### Blocks framed on the sheet
3V3 ANALOG: B1 C8 C42
EXTERNAL CONNECTORS: J1 J3
STATUS LEDS: LED1-LED3 R7 R9 R13
5V REGULATOR: C1 C2 IC5

### Nets
3V3: B1.2(OUTPUT) B1.4(VOUT) C42.1 LED1.2(A)  [also labelled +3V3]
12V: C1.2 IC5.1(IN) J1.1 J1.2 J1.3 J1.4 LED2.2(A)  [also labelled +12V]
+5V: B1.3(INPUT) C2.1 C8.1 IC5.3(OUT) LED3.2(A)
GND: B1.1(ADJ/GND) C1.1 C2.2 C8.2 C42.2 IC5.2(GND_1) IC5.4(GND_2) J3.1 J3.2 J3.3 J3.4 R7.2 R9.2 R13.1
NetLED1_1: LED1.1(K) R7.1
NetLED2_1: LED2.1(K) R13.2
NetLED3_1: LED3.1(K) R9.1

Not connected (* = marked no-connect by the designer): J1 MP1* MP2*; J3 MP1* MP2*

### Library data of the parts
B1 = CMP-027-000000-1: LDO Voltage Regulators LDO BJT HiCurr 1.35A 10Hz to 10KHz; Manufacturer_Name: Diodes Incorporated; Geometry.Height: 1.8mm; Manufacturer_Part_Number: AZ1117IH-3.3TRG1; Mouser Price/Stock: https://www.mouser.co.uk/ProductDetail/Diodes-Incorporated/AZ1117IH-3.3TRG1?qs=cpo3%2FpBou2jnS4SxLgAVoA%3D%3D; Arrow Part Number: AZ1117IH-3.3TRG1; Source: AZ1117IH-3.3TRG1.SchLib; Design Item ID: AZ1117IH-3.3TRG1; Datasheet Link: https://www.diodes.com//assets/Datasheets/AZ1117I.pdf; Arrow Price/Stock: https://www.arrow.com/en/products/az1117ih-3.3trg1/diodes-incorporated?utm_currency=USD&region=europe; Mouser Part Number: 621-AZ1117IH-3.3TRG1
C1 = GRM188R61H474KA12D: Manufacturer_Name: Murata Electronics; Datasheet Link: https://search.murata.co.jp/Ceramy/image/img/A01X/G101/ENG/GRM188R61H474KA12-04A.pdf; Height: 0.9mm; Manufacturer_Part_Number: GRM188R61H474KA12D; Mouser Part Number: 81-GRM188R61H474KA2D; Mouser Price/Stock: https://www.mouser.co.uk/ProductDetail/Murata-Electronics/GRM188R61H474KA12D?qs=4W3PNmGdEWHPXU2UiOr6Bg%3D%3D; Arrow Part Number: GRM188R61H474KA12D; Arrow Price/Stock: https://www.arrow.com/en/products/grm188r61h474ka12d/murata-manufacturing
C2 C42 = CC0603MRX5R6BB226: Manufacturer_Name: Yageo Group; Datasheet Link: https://www.yageo.com/upload/media/product/productsearch/datasheet/mlcc/UPY-GPHC_X5R_4V-to-50V_30.pdf; Height: 1mm; Manufacturer_Part_Number: CC0603MRX5R6BB226; Mouser Part Number: 603-CC603MRX5R6BB226; Mouser Price/Stock: https://www.mouser.co.uk/ProductDetail/YAGEO/CC0603MRX5R6BB226?qs=IvkZ4pJZlB3K%252BVkAL36Ang%3D%3D
C8 = GRM155R61A106ME11D: Manufacturer_Name: Murata Electronics; Datasheet Link: https://search.murata.co.jp/Ceramy/image/img/A01X/G101/ENG/GRM155R61A106ME11-01A.pdf; Height: 0.33mm; Manufacturer_Part_Number: GRM155R61A106ME11D; Mouser Part Number: 81-GRM155R61A106ME1D; Mouser Price/Stock: https://www.mouser.co.uk/ProductDetail/Murata-Electronics/GRM155R61A106ME11D?qs=xZ%2FP%252Ba9zWqZMJSi57Q8OyA%3D%3D; Arrow Part Number: GRM155R61A106ME11D; Arrow Price/Stock: https://www.arrow.com/en/products/grm155r61a106me11d/murata-manufacturing?utm_currency=USD&region=nac
IC5 = LM2940IMPX-5.0_NOPB: Integrated Circuit; Manufacturer_Name: Texas Instruments; Manufacturer_Part_Number: LM2940IMPX-5.0/NOPB; Datasheet Link: http://www.ti.com/lit/gpn/lm2940-n; Height: 1.8mm; Mouser Part Number: 926-LM2940IMPX50NOPB; Mouser Price/Stock: https://www.mouser.co.uk/ProductDetail/Texas-Instruments/LM2940IMPX-5.0-NOPB?qs=X1J7HmVL2ZELzMHXu8bpyQ%3D%3D; Arrow Part Number: LM2940IMPX-5.0/NOPB; Arrow Price/Stock: https://www.arrow.com/en/products/lm2940impx-5.0nopb/texas-instruments?utm_currency=USD&region=nac
J1 J3 = 0532610471: Connector; Manufacturer_Name: Molex; Datasheet Link: https://www.molex.com/en-us/products/part-detail-pdf/532610471?display=pdf; Height: 3.6mm; Manufacturer_Part_Number: 0532610471; Mouser Part Number: N/A; Mouser Price/Stock: https://www.mouser.co.uk/ProductDetail/Molex/0532610471?qs=PBcRNPEHKsrtKT62ep6ONg%3D%3D; Arrow Part Number: 0532610471; Arrow Price/Stock: https://www.arrow.com/en/products/0532610471/molex.html?utm_currency=USD&region=europe
LED1-LED3 = LTST-C190KGKT: LED; Manufacturer_Name: Lite-On; Datasheet Link: http://uk.rs-online.com/web/p/visible-leds/6920988/; Height: 0.8mm; Manufacturer_Part_Number: LTST-C190KGKT; Mouser Part Number: 859-LTST-C190KGKT; Mouser Price/Stock: https://www.mouser.co.uk/ProductDetail/Lite-On/LTST-C190KGKT?qs=205qCy6M2Q%252BAdcgwUZktqw%3D%3D; Arrow Part Number: LTST-C190KGKT; Arrow Price/Stock: https://www.arrow.com/en/products/ltst-c190kgkt/lite-on-technology?utm_currency=USD&region=nac
R7 R9 = RC0603FR-131KL: Manufacturer_Name: Yageo Group; Datasheet Link: http://www.yageo.com/documents/recent/PYu-RC0603_51_RoHS_L_v5.pdf; Height: 0.55mm; Manufacturer_Part_Number: RC0603FR-131KL; Mouser Part Number: 603-RC0603FR-131KL; Mouser Price/Stock: https://www.mouser.co.uk/ProductDetail/Yageo/RC0603FR-131KL?qs=EiqXWrxQq60RfsVJHVHHSQ%3D%3D; Arrow Part Number: RC0603FR-131KL; Arrow Price/Stock: https://www.arrow.com/en/products/rc0603fr-131kl/yageo
R13 = AC0603FR-074K7L: Manufacturer_Name: Yageo Group; Datasheet Link: https://www.mouser.in/ProductDetail/YAGEO/AC0603FR-074K7L?qs=UoPT7wUmgYKKC9qeAwzsVg%3D%3D; Height: 0.55mm; Manufacturer_Part_Number: AC0603FR-074K7L; Mouser Part Number: 603-AC0603FR-074K7L; Mouser Price/Stock: https://www.mouser.co.uk/ProductDetail/YAGEO/AC0603FR-074K7L?qs=UoPT7wUmgYKKC9qeAwzsVg%3D%3D; Arrow Part Number: AC0603FR-074K7L; Arrow Price/Stock: https://www.arrow.com/en/products/ac0603fr-074k7l/yageo?region=europe

## Sheet LPF_PA.SchDoc
size A; SheetNumber: 2; SheetTotal: 7
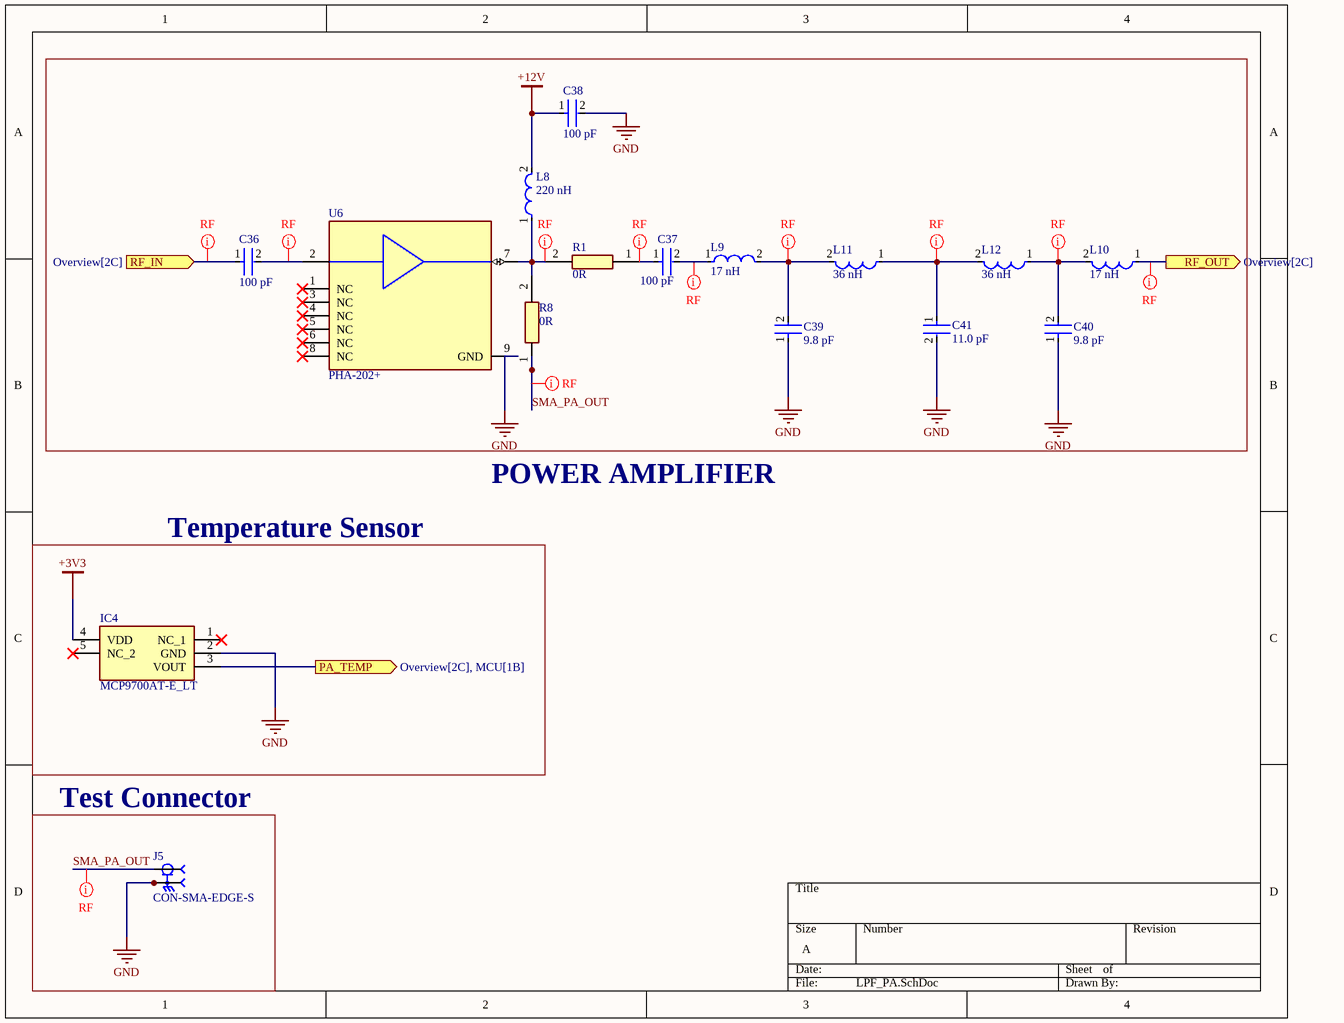
[diagram p4: LPF_PA.SchDoc]

### Parts
C36  100 pF  [FP-GQM187-0_15-MFG]
C37  100 pF  [FP-GQM187-0_15-MFG]
C38  100 pF  [FP-GQM187-0_15-MFG]
C39  9.8 pF  [FP-GJM155-0_05-IPC_A]
C40  9.8 pF  [FP-GJM155-0_05-IPC_A]
C41  11.0 pF  [FP-GJM155-0_05-IPC_B]
IC4  MCP9700AT-E_LT  [SOT65P210X110-5N]
J5  CON-SMA-EDGE-S  [RFSOLUTIONS_CON-SMA-EDGE-S]
L8  220 nH  [FP-LQW18AN_80-MFG]
L9  17 nH  [FP-LQW18AN_80-MFG]
L10  17 nH  [FP-LQW18AN_80-MFG]
L11  36 nH  [FP-LQW18AN_80-MFG]
L12  36 nH  [FP-LQW18AN_80-MFG]
R1  0R  [RESC1608X55N]
R8  0R  [RESC1608X55N]
U6  PHA-202+  [FP-DL1636-MFG]

### Blocks framed on the sheet
Temperature Sensor: IC4
Test Connector: J5

### Ports
PA_TEMP (out, see Overview[2C], MCU[1B]), RF_IN (in, see Overview[2C]), RF_OUT (out, see Overview[2C])

### Nets
+3V3: IC4.4(VDD)  [project net 3V3]
+12V: C38.1 L8.2  [project net 12V]
GND: C38.2 C39.1 C40.1 C41.2 IC4.2(GND) J5.G1 J5.G2 J5.G3 J5.G4 U6.9(GND)
SMA_PA_OUT: J5.1 R8.1
NetC31_2: L10.1 ; port RF_OUT
NetC36_1: C36.1 ; port RF_IN
NetC36_2: C36.2 U6.2(RF-IN)
NetC37_1: C37.1 R1.1
NetC37_2: C37.2 L9.1
NetC39_2: C39.2 L9.2 L11.2
NetC40_2: C40.2 L10.2 L12.1
NetC41_1: C41.1 L11.1 L12.2
NetIC2_23: IC4.3(VOUT) ; port PA_TEMP
NetL8_1: L8.1 R1.2 R8.2 U6.7(RF-OUT&DC-IN)

Not connected (* = marked no-connect by the designer): IC4 1(NC_1)* 5(NC_2)*; U6 1(NC)* 3(NC)* 4(NC)* 5(NC)* 6(NC)* 8(NC)*

### Layout directives
rule Impedance Constraint [Min = 50.00    Max = 50.00    ]; net class RF: NetC31_2, NetC36_1, NetC36_2, NetC37_1, NetC37_2, NetC39_2, NetC40_2, NetC41_1, NetL8_1, SMA_PA_OUT

### Notes on the sheet
- POWER AMPLIFIER

### Library data of the parts
C36-C38 = CMP-06035-018516-1: as C6 on sheet si4463; Min Operating Temperature: -55°C; Case Code (Metric): 1608; Lead Free: Lead Free; Length: 1.6mm; Voltage Rating: 250V; Termination: SMD/SMT; Packaging: Tape and Reel; Width: 0.031inch; Tolerance: 5%; Thickness: 0.031inch; Capacitance: 100pF; Package Quantity: 4000; Case/Package: 0603; Mount: Surface Mount; Max Operating Temperature: 125°C; Dielectric: C0G; Depth: 0.8mm; Case Code (Imperial): 0603
C39 C40 = CMP-2008-03896-2: Multi-Layer Ceramic Capacitor 9.8pF C0G  ±0.05pF 0402 Paper T/R Name: GJM1555C1H9R8WB01D; Voltage Rating: 50V; Package Quantity: 10000; Termination: SMD/SMT; Min Operating Temperature: -55°C; Case/Package: 0402; Case Code (Imperial): 0402; Width: 0.02inch; Case Code (Metric): 1005; Height: 0.5mm; Max Operating Temperature: 125°C; Depth: 0.5mm; Dielectric: C0G; Thickness: 0.022inch; Capacitance: 9.8pF; Mount: Surface Mount; Length: 1mm; Packaging: Tape and Reel; Voltage Rating (DC): 50V; Radiation Hardening: No
C41 = CMP-2008-03798-2: Multi-Layer Ceramic Capacitor 11pF C0G  ±2% 0402 Paper T/R Name: GJM1555C1H110GB01D; Voltage Rating (DC): 50V; Dielectric: C0G; Case/Package: 0402; Mount: Surface Mount; Case Code (Imperial): 0402; Case Code (Metric): 1005; Max Operating Temperature: 125°C; Capacitance: 11pF; Height: 0.5mm; Depth: 0.5mm; Voltage Rating: 50V; Thickness: 0.022inch; Tolerance: 2%; Width: 0.5mm; Packaging: Tape and Reel; Termination: SMD/SMT; Min Operating Temperature: -55°C; Package Quantity: 10000; Lead Free: Lead Free; Length: 1mm; Radiation Hardening: No
IC4 = MCP9700AT-E_LT: Integrated Circuit; Manufacturer_Name: Microchip; Manufacturer_Part_Number: MCP9700AT-E/LT; Datasheet Link: https://datasheet.datasheetarchive.com/originals/distributors/SFDatasheet-4/sf-00090116.pdf; Height: 1.1mm; Mouser Part Number: 579-MCP9700AT-E/LT; Mouser Price/Stock: https://www.mouser.co.uk/ProductDetail/Microchip-Technology/MCP9700AT-E-LT?qs=RnzODY3cU8v4O6DkGIhmqg%3D%3D; Arrow Part Number: MCP9700AT-E/LT; Arrow Price/Stock: https://www.arrow.com/en/products/mcp9700at-elt/microchip-technology?utm_currency=USD&region=nac
J5 = CMP-002-00088-1: as J6 on sheet si4463; Source: CON-SMA-EDGE-S.SchLib; Check_prices: https://www.snapeda.com/parts/CON-SMA-EDGE-S/RF+Solutions/view-part/?ref=eda; Component Type: Standard; Purchase-URL: https://pricing.snapeda.com/search/part/CON-SMA-EDGE-S/?ref=eda; MP: CON-SMA-EDGE-S; SnapEDA_Link: https://www.snapeda.com/parts/CON-SMA-EDGE-S/RF+Solutions/view-part/?ref=snap; Pins: 5; Case/Package: None; Value: *; Digi-Key_Part_Number: CON-SMA-EDGE-S-ND; Design Item ID: CON-SMA-EDGE-S
L8 = CMP-06042-006715-1: as L3 on sheet si4463
L9 L10 = CMP-06042-009310-1: Wire Wound RF Inductor for Automotive 17nH ±2% 1400mA 0.075Ω 0603 (1608) Name: LQW18AN17NG8ZD
L11 L12 = CMP-06042-006264-1: Wire Wound RF Inductor for Automotive 36nH ±5% 910mA 0.2Ω 0603 (1608) Name: LQW18AN36NJ8ZD
R1 R8 = RC0603JR-070RL: Manufacturer_Name: Yageo Group; Datasheet Link: http://www.yageo.com/documents/recent/PYu-RC0603_51_RoHS_L_v5.pdf; Height: 0.55mm; Manufacturer_Part_Number: RC0603JR-070RL; Mouser Part Number: 603-RC0603JR-070RL; Mouser Price/Stock: https://www.mouser.co.uk/ProductDetail/YAGEO/RC0603JR-070RL?qs=2cAdsCoAWRGWyPcuXgGiXQ%3D%3D; Arrow Part Number: RC0603JR-070RL; Arrow Price/Stock: https://www.arrow.com/en/products/rc0603jr-070rl/yageo?utm_currency=USD&region=nac
U6 = CMP-199891-000001-1: Ultra High Dynamic Range Monolithic Amplifier; Manufacturer: Mini-Circuits; Max Power Dissipation: 5.8W; Max Junction Temp: +179°C; Bandwidth: 0.03-2.7GHz; Noise Figure: 5.4dB; P1Db: 30.4dBm; Max Frequency: 2.7GHz; Gain: 12.7dB; Nominal Supply Current: 350mA; RoHS: TRUE; Temperature: -40°C to +85°C; Device Class L1: Integrated Circuits (ICs); ComponentLink2Description: Datasheet; Category: IC; Footprint Url: https://ww3.minicircuits.com/case_style/DL1636.pdf; Device Class L3: RF Amplifiers; Temperature Range High: +85°C; Manufacturer Part Number: PHA-202+; Package: DL1636; Temperature Range Low: -40°C; Automotive: No; Lead Free: Yes; Height: 0.039inch; Device Class L2: RF Semiconductors and Devices; Octopart: https://octopart.com/pha-202%2B-mini-circuits-107467474; Ipc Land Pattern Name: DFN490X599X89-8; ComponentLink2URL: https://ww3.minicircuits.com/pdfs/PHA-202+.pdf

## Sheet BPF_LNA.SchDoc
size A; SheetNumber: 7; SheetTotal: 7
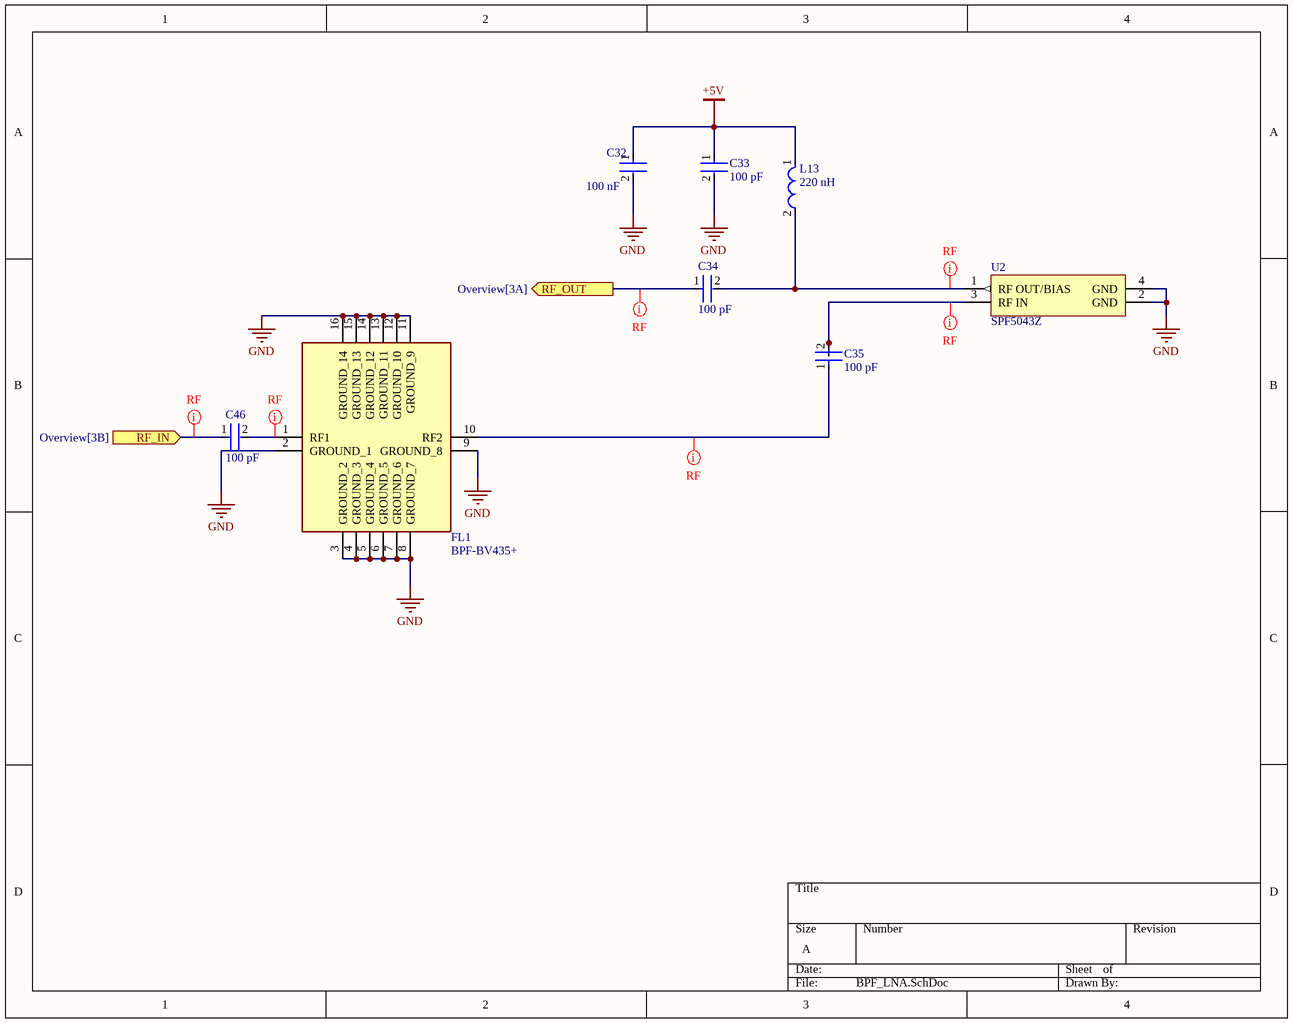
[diagram p5: BPF_LNA.SchDoc]

### Parts
C32  100 nF  [FP-GCM155-0_05-IPC_C]
C33  100 pF  [FP-GQM187-0_15-MFG]
C34  100 pF  [FP-GQM187-0_15-MFG]
C35  100 pF  [FP-GQM187-0_15-MFG]
C46  100 pF  [FP-GQM187-0_15-MFG]
FL1  BPF-BV435+  [BPFBV435]
L13  220 nH  [FP-LQW18AN_80-MFG]
U2  SPF5043Z  [RFMD-SOT343-4_M]

### Ports
RF_IN (in, see Overview[3B]), RF_OUT (out, see Overview[3A])

### Nets
+5V: C32.1 C33.1 L13.1
GND: C32.2 C33.2 FL1.2(GROUND_1) FL1.3(GROUND_2) FL1.4(GROUND_3) FL1.5(GROUND_4) FL1.6(GROUND_5) FL1.7(GROUND_6) FL1.8(GROUND_7) FL1.9(GROUND_8) FL1.11(GROUND_9) FL1.12(GROUND_10) FL1.13(GROUND_11) FL1.14(GROUND_12) FL1.15(GROUND_13) FL1.16(GROUND_14) U2.2(GND) U2.4(GND)
NetC5_1: C34.1 ; port RF_OUT
NetC34_2: C34.2 L13.2 U2.1(RF_OUT/BIAS)
NetC35_1: C35.1 FL1.10(RF2)
NetC35_2: C35.2 U2.3(RF_IN)
NetC46_1: C46.1 ; port RF_IN
NetC46_2: C46.2 FL1.1(RF1)

### Layout directives
rule Impedance Constraint [Min = 50.00    Max = 50.00    ]; net class RF: NetC5_1, NetC34_2, NetC35_1, NetC35_2, NetC46_1, NetC46_2

### Library data of the parts
C32 = CMP-2008-03711-3: as C4 on sheet si4463; Termination: SMD/SMT; Length: 1mm; Voltage: 16V; Mount: Surface Mount; Packaging: Tape and Reel; Case Code (Metric): 1005; Case/Package: 0402; Voltage Rating: 16V; Min Operating Temperature: -55°C; Case Code (Imperial): 0402; Ratings: AEC-Q200; Height: 0.5mm; Tolerance: 10%; Width: 0.02inch; Radiation Hardening: No; Depth: 0.5mm; Capacitance: 100nF; Max Operating Temperature: 125°C; Package Quantity: 1; REACH SVHC: No SVHC; Thickness: 0.022inch; Dielectric: X7R; Lead Free: Lead Free
C33-C35 C46 = CMP-06035-018516-1: as C6 on sheet si4463; Min Operating Temperature: -55°C; Case Code (Metric): 1608; Lead Free: Lead Free; Length: 1.6mm; Voltage Rating: 250V; Termination: SMD/SMT; Packaging: Tape and Reel; Width: 0.031inch; Tolerance: 5%; Thickness: 0.031inch; Capacitance: 100pF; Package Quantity: 4000; Case/Package: 0603; Mount: Surface Mount; Max Operating Temperature: 125°C; Dielectric: C0G; Depth: 0.8mm; Case Code (Imperial): 0603
FL1 = BPF-BV435+: Filter; Manufacturer_Name: Mini-Circuits; Datasheet Link: https://eu.mouser.com/datasheet/3/3705/1/BPF_BV435.pdf; Height: 6.35mm; Manufacturer_Part_Number: BPF-BV435+
L13 = CMP-06042-006715-1: as L3 on sheet si4463
U2 = CMP-2000-05330-1: AMP, RF, LNA, 50-4000MHZ, SOT343; Manufacturer: RF Micro Devices; Online Catalog: RFMDAmplifiers; RF Type: Cellular,ISM,PCS; Frequency: 50MHz~4GHz; Other Names: 689-1101-6; Current - Supply: 46mA; P1dB: 22.7dB; Gain: 12.9dB; Test Frequency: 1.9GHz; Voltage - Supply: 3V~5V; Noise Figure: 0.8dB; Datasheet URL: http://www.rfmd.com/store/downloads/dl/file/id/27713/spf5043z_data_sheet.pdf; Packaging: Digi-Reel; Package / Case: SC-82A,SOT-343; Family: RFAmplifiers; Series: -; Datasheet Version: Jan-16; Standard Package: 1; Category: RF/IFandRFID; Supplier Device Package: SOT-343; Manufacturer URL: http://www.qorvo.com/

## Sheet SW_ANT.SchDoc
size A; SheetNumber: 6; SheetTotal: 7
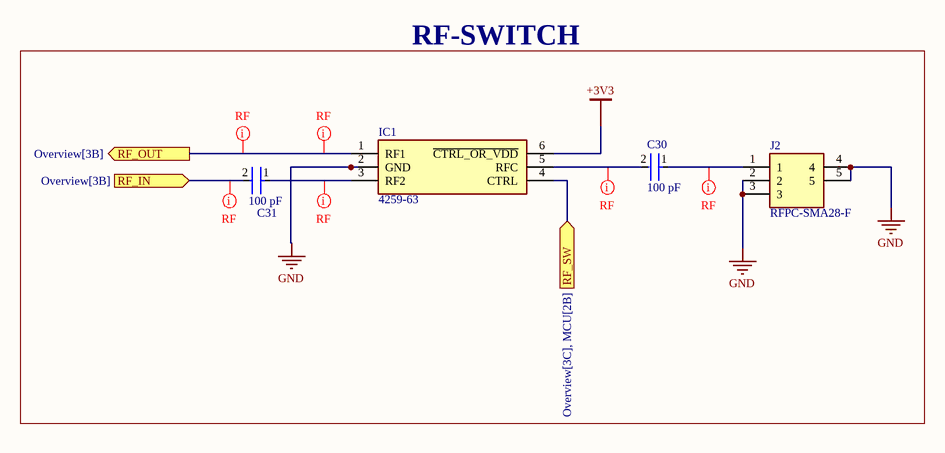
[diagram p6: SW_ANT.SchDoc]

### Parts
C30  100 pF  [FP-GQM187-0_15-MFG]
C31  100 pF  [FP-GQM187-0_15-MFG]
IC1  4259-63  [SOT65P210X110-6N]
J2  RFPC-SMA28-F  [RFPCSMA28F]

### Blocks framed on the sheet
RF-SWITCH: C30 C31 IC1 J2

### Ports
RF_IN (in, see Overview[3B]), RF_OUT (out, see Overview[3B]), RF_SW (in, see Overview[3C], MCU[2B])

### Nets
+3V3: IC1.6(~{CTRL_OR_VDD})  [project net 3V3]
GND: IC1.2(GND) J2.2 J2.3 J2.4 J2.5
RF_SW: IC1.4(CTRL) ; port RF_SW
NetC30_1: C30.1 J2.1
NetC30_2: C30.2 IC1.5(RFC)
NetC31_1: C31.1 IC1.3(RF2)
NetC31_2: C31.2 ; port RF_IN
NetC46_1: IC1.1(RF1) ; port RF_OUT

### Layout directives
rule Impedance Constraint [Min = 50.00    Max = 50.00    ]; net class RF: NetC30_1, NetC30_2, NetC31_1, NetC31_2, NetC46_1

### Library data of the parts
C30 C31 = CMP-06035-018516-1: as C6 on sheet si4463; Min Operating Temperature: -55°C; Case Code (Metric): 1608; Lead Free: Lead Free; Length: 1.6mm; Voltage Rating: 250V; Termination: SMD/SMT; Packaging: Tape and Reel; Width: 0.031inch; Tolerance: 5%; Thickness: 0.031inch; Capacitance: 100pF; Package Quantity: 4000; Case/Package: 0603; Mount: Surface Mount; Max Operating Temperature: 125°C; Dielectric: C0G; Depth: 0.8mm; Case Code (Imperial): 0603
IC1 = 4259-63: Integrated Circuit; Manufacturer_Name: Peregrine Semiconductor; Datasheet Link: http://www.psemi.com/pdf/datasheets/pe4259ds.pdf; Height: 1.1mm; Manufacturer_Part_Number: 4259-63; Mouser Part Number: 81-4259-63; Mouser Price/Stock: https://www.mouser.co.uk/ProductDetail/pSemi/4259-63?qs=iw0hurA%2FaD37qvQcKdATTw%3D%3D
J2 = RFPC-SMA28-F: Connector; Manufacturer_Name: GCT (GLOBAL CONNECTOR TECHNOLOGY); Datasheet Link: https://www.mouser.kr/datasheet/3/1507/1/RFPC-SMA28-F.pdf; Height: 9.8mm; Manufacturer_Part_Number: RFPC-SMA28-F

## Nets that join several sheets
3V3: MCU (22 pins), si4463 (10 pins), Power_regulation (B1.2 B1.4 C42.1 LED1.2), LPF_PA (IC4.4), SW_ANT (IC1.6)
12V: Power_regulation (7 pins), LPF_PA (C38.1 L8.2)
+5V: Power_regulation (5 pins), BPF_LNA (C32.1 C33.1 L13.1)
GND: MCU (26 pins), si4463 (21 pins), Power_regulation (14 pins), LPF_PA (10 pins), BPF_LNA (18 pins), SW_ANT (5 pins)
NetC5_1: si4463 (C5.1), BPF_LNA (C34.1)
NetC31_2: LPF_PA (L10.1), SW_ANT (C31.2)
NetC36_1: si4463 (R11.1), LPF_PA (C36.1)
NetC46_1: BPF_LNA (C46.1), SW_ANT (IC1.1)
NetIC2_23: MCU (IC2.23), LPF_PA (IC4.3)
NetIC2_26: MCU (IC2.26), si4463 (IC3.9)
NetIC2_27: MCU (IC2.27), si4463 (IC3.10)
NetIC2_28: MCU (IC2.28), si4463 (IC3.19)
NetIC2_54: MCU (IC2.54), si4463 (IC3.20)
NIRQ: MCU (IC2.21), si4463 (IC3.11)
NSEL: MCU (IC2.16), si4463 (IC3.15)
RF_SW: MCU (IC2.15), SW_ANT (IC1.4)
SCLK: MCU (IC2.22), si4463 (IC3.12)
SDI: MCU (IC2.17), si4463 (IC3.14)
SDO: MCU (IC2.20), si4463 (IC3.13)

## Assembly variants
V01: not fitted C23 L6 L7 R6 R8 R10 R12